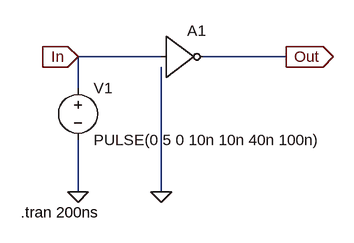
[diagram p0: schematic invertor.asc]
invertor.asc, the LTspice schematic file:
Version 4.1
SHEET 1 880 680
WIRE 384 -448 256 -448
WIRE 576 -448 448 -448
WIRE 256 -400 256 -448
WIRE 256 -240 256 -320
WIRE 384 -240 384 -432
FLAG 384 -240 0
FLAG 256 -240 0
FLAG 256 -448 In
IOPIN 256 -448 In
FLAG 576 -448 Out
IOPIN 576 -448 Out
SYMBOL Digital\\inv 384 -512 R0
SYMATTR InstName A1
SYMBOL voltage 256 -416 R0
WINDOW 123 0 0 Left 0
WINDOW 39 0 0 Left 0
SYMATTR InstName V1
SYMATTR Value PULSE(0 5 0 10n 10n 40n 100n)
TEXT 168 -208 Left 2 !.tran 200ns

The netlist it stands for:
* invertor.asc
A1 In 0 0 0 0 Out 0 0 BUF
V1 In 0 PULSE(0 5 0 10n 10n 40n 100n)
.tran 200ns
.backanno
.end